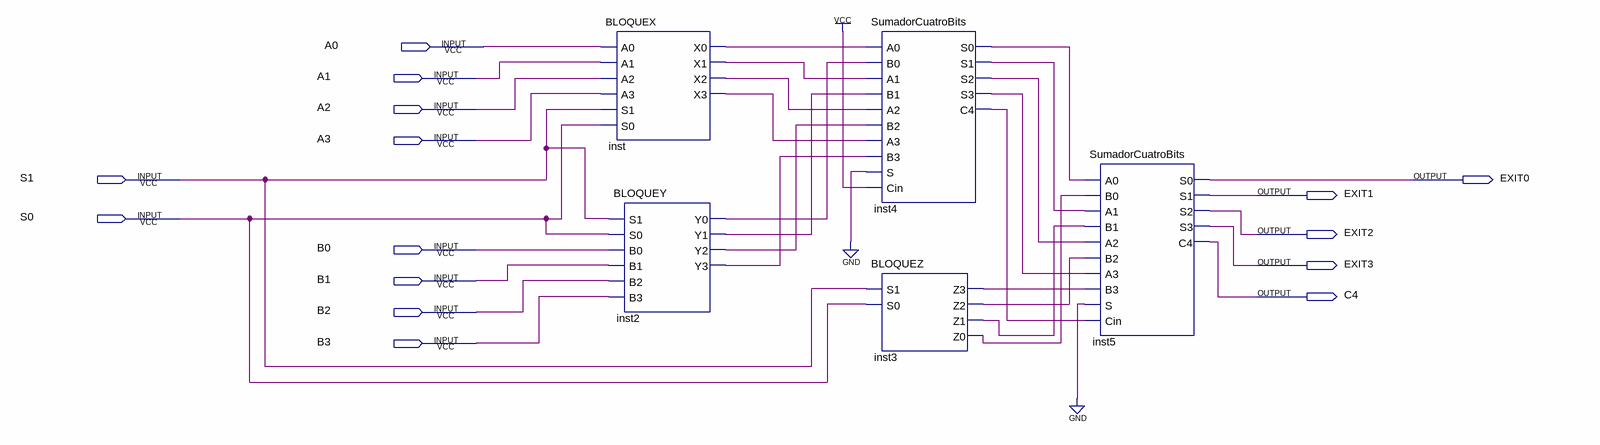
[diagram p0: schematic sheet]
// Quartus schematic ALUCORREGIDA.bdf as structural Verilog: 5 symbols, 15 pins
module ALUCORREGIDA (
  input  A0,
  input  A1,
  input  A2,
  input  A3,
  input  S1,
  input  S0,
  input  B0,
  input  B1,
  input  B2,
  input  B3,
  output EXIT0,
  output EXIT1,
  output EXIT2,
  output EXIT3,
  output C4
);

  wire inst2_y0, inst2_y1, inst2_y2, inst2_y3, inst3_z0, inst3_z1, inst3_z2, inst3_z3, inst4_c4, inst4_s0,
       inst4_s1, inst4_s2, inst4_s3, inst_x0, inst_x1, inst_x2, inst_x3;

  BLOQUEX inst (
    .A0(A0), .A1(A1), .A2(A2), .A3(A3), .S1(S1), .S0(S0), .X0(inst_x0), .X1(inst_x1), .X2(inst_x2),
    .X3(inst_x3));
  BLOQUEY inst2 (
    .S1(S1), .S0(S0), .B0(B0), .B1(B1), .B2(B2), .B3(B3), .Y0(inst2_y0), .Y1(inst2_y1), .Y2(inst2_y2),
    .Y3(inst2_y3));
  SumadorCuatroBits inst4 (
    .A0(inst_x0), .B0(inst2_y0), .A1(inst_x1), .B1(inst2_y1), .A2(inst_x2), .B2(inst2_y2), .A3(inst_x3),
    .B3(inst2_y3), .S(1'b0), .Cin(1'b1), .S0(inst4_s0), .S1(inst4_s1), .S2(inst4_s2), .S3(inst4_s3),
    .C4(inst4_c4));
  BLOQUEZ inst3 (.S1(S1), .S0(S0), .Z3(inst3_z3), .Z2(inst3_z2), .Z1(inst3_z1), .Z0(inst3_z0));
  SumadorCuatroBits inst5 (
    .A0(inst4_s0), .B0(inst3_z0), .A1(inst4_s1), .B1(inst3_z1), .A2(inst4_s2), .B2(inst3_z2), .A3(inst4_s3),
    .B3(inst3_z3), .S(1'b0), .Cin(inst4_c4), .S0(EXIT0), .S1(EXIT1), .S2(EXIT2), .S3(EXIT3), .C4(C4));
endmodule
